# EAGLE design Power-Board (EAGLE 7.2.0)
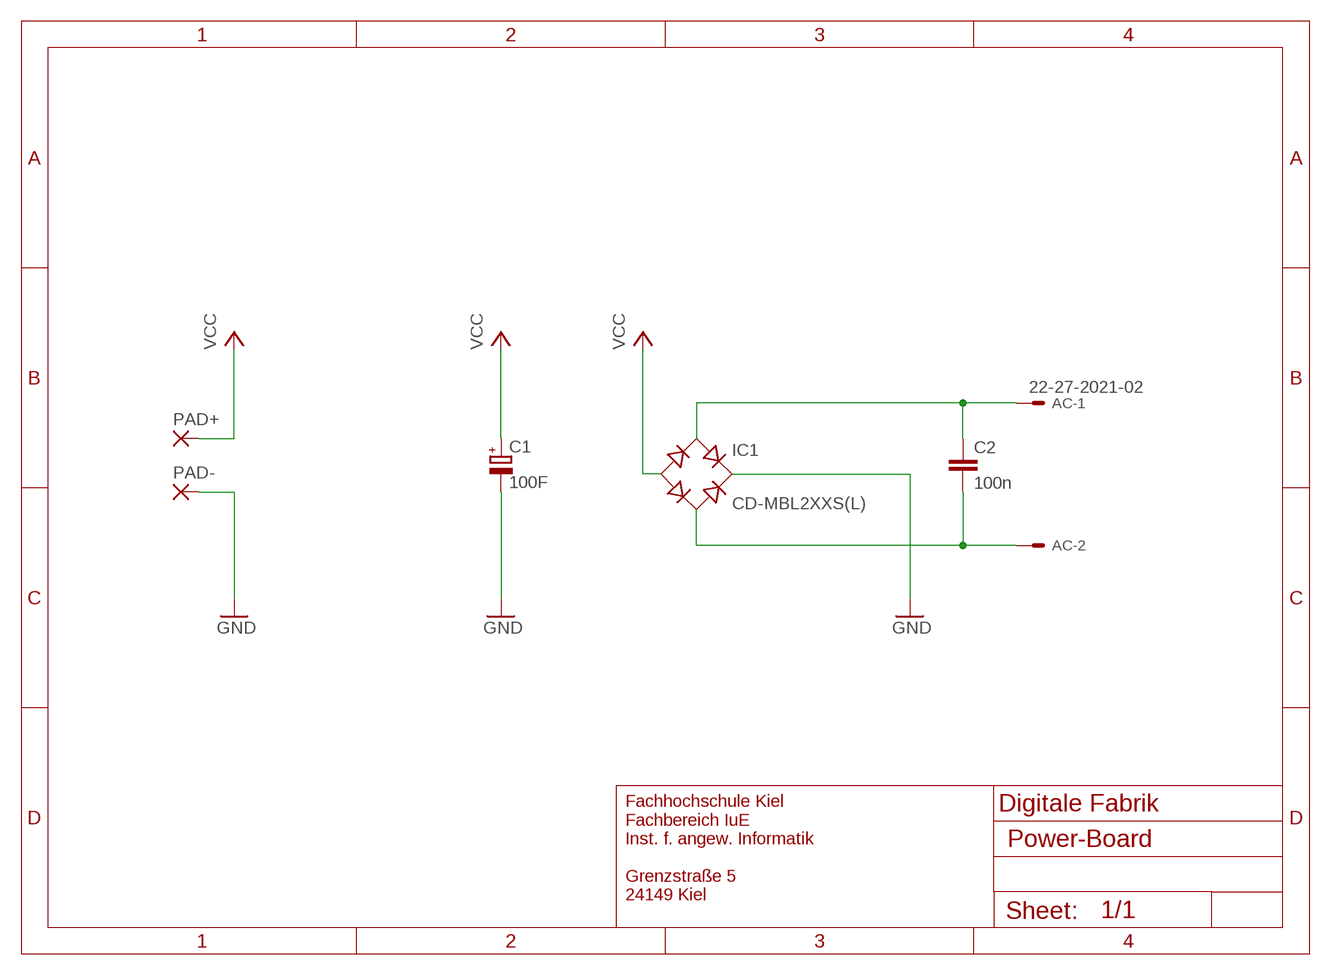
[diagram p0: schematic, sheet 1]

## Parts
AC  22-27-2021-02  [6410-02]
C1  100F  CPOL-EUE7,5-18,5  [E7,5-18,5]
C2  100n  C-EUC0805K  [C0805K]
IC1  CD-MBL2XXS(L)  [CD-MBL2XXS(L)]
PAD+  WIREPAD4,16O1,6  [4,16O1,6]
PAD-  WIREPAD4,16O1,6  [4,16O1,6]

## Nets
GND: C1.- IC1.DC+(+) PAD-.1(P)
N$1: AC.1 C2.1 IC1.AC1
N$2: AC.2 C2.2 IC1.AC2
VCC: C1.+ IC1.DC-(-) PAD+.1(P)

## Notes on the sheet
- Digitale Fabrik
- Fachhochschule Kiel
  Fachbereich IuE
  Inst. f. angew. Informatik
  
  Grenzstraße 5
  24149 Kiel

## Library data of the parts
AC = con-molex:22-?-02: CONNECTOR wire to board 2.54 mm (.1 inch) pitch header
C1 = rcl:CPOL-EU: POLARIZED CAPACITOR, European symbol
C2 = rcl:C-EU: CAPACITOR, European symbol
IC1 = rectifier:CD-MBL2XXS(L): Bourns CD-MBL2xxS(L) series SMT bridge rectifier diode
PAD+ PAD- = wirepad:WIREPAD: Wire PAD connect wire on PCB

## Board
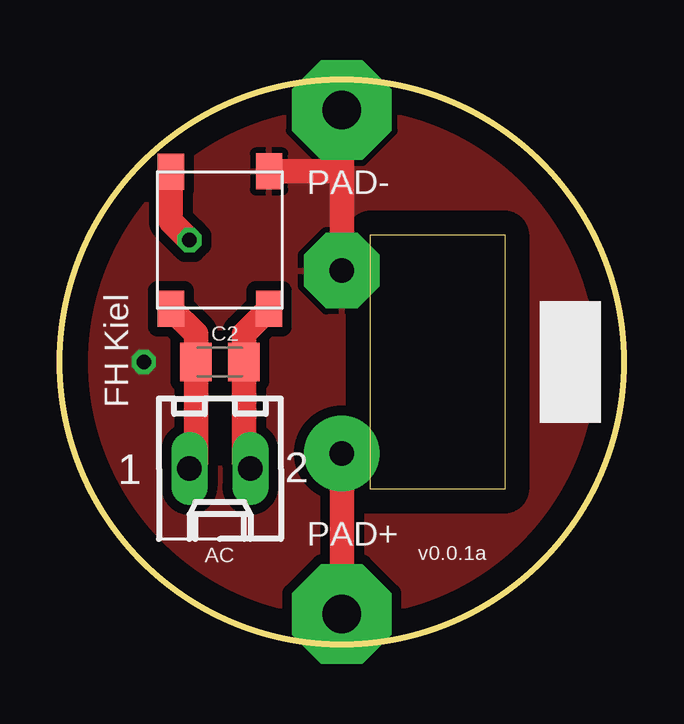
[diagram p1: board, top side]
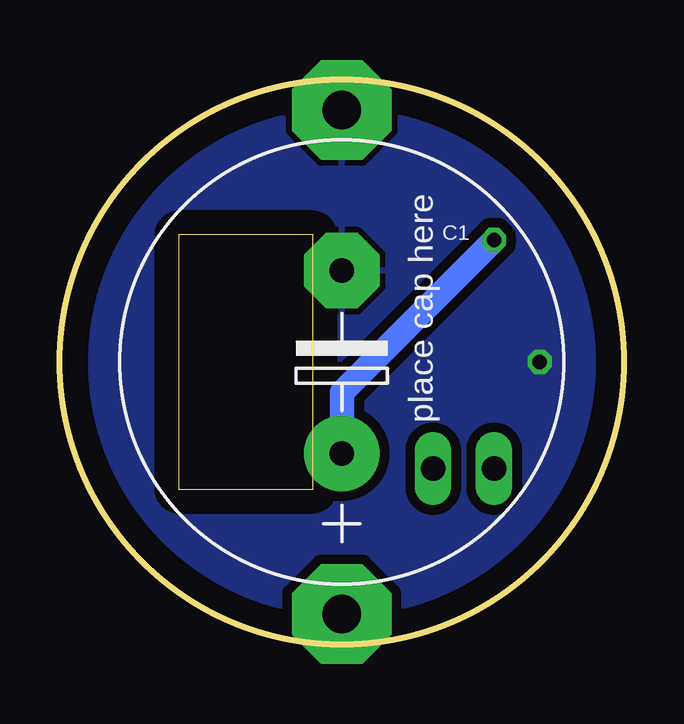
[diagram p2: board, bottom side, seen from below]

Size 23.5 x 23.5 mm. Coordinates in mm from the lower left corner, seen from the top.
Outline: 12.95,17.05 18.55,17.05 18.55,6.45 12.95,6.45 12.95,17.05
Outline: circle at 11.75,11.75 radius 11.75
Copper layers (1*16): Top 0.035mm / dielectric 1.5mm / Bottom 0.035mm
Design rules "default": minimum track width 10mil, minimum drill 24mil, track to track 8mil, track to pad 8mil, pad to pad 8mil, via to via 8mil, smd to smd 8mil, copper to edge 40mil, drill to drill 8mil, minimum pad ring 10mil, minimum via ring 8mil, stop-mask expansion 4mil, vias tented up to drill 0mil, thermal gap 10mil

### Footprints (pad centres in the part's own frame; a part is rotated, then mirrored left to right if it is on the bottom)
6410-02 = drill 1.016 long: 1 1.27,0; 2 -1.27,0
E7,5-18,5 = drill 1.016 pad 3.15: + -3.81,0 | drill 1.016 pad 3.15 octagon: - 3.81,0
C0805K = smd 1.3 x 1.6: 1 -1,0; 2 1,0
CD-MBL2XXS(L) = smd 1.1 x 1.5: AC1 -2.05,-2.86; AC2 2.05,-2.86; DC+ 2.05,2.86; DC- -2.05,2.85
4,16O1,6 = drill 1.6 pad 4.166 octagon: 1 0,0

### Placement (x,y rotation side)
AC  6.67,7.3 180 top
C1  11.75,11.75 90 bottom
C2  6.67,11.75 0 top
IC1  6.67,16.83 0 top
PAD+  11.75,1.25 0 top
PAD-  11.75,22.25 0 top

### Tracks (layer width: path | path; a pad name or v marks a point on that pad's centre or on a via)
GND  (via drill 0.6)
  Top 1.016: C1.- 11.75,20.01 | 11.75,20.01 PAD-.1 | IC1.DC+ 11.44,19.69 11.75,20.01
  other vias: 3.49,11.75
  pour Bottom (isolate 0.406): -0.31,-0.31 -0.31,23.81 23.81,23.81 23.81,-0.31
  pour Top (isolate 0.406): -0.31,-0.31 -0.31,23.81 23.81,23.81 23.81,-0.31
N$1
  Top 1.016: IC1.AC1 5.67,12.92 C2.1 5.67,7.58 AC.1
N$2
  Top 1.016: IC1.AC2 7.67,12.92 C2.2 7.67,7.58 AC.2
VCC  (via drill 0.6)
  Top 1.016: C1.+ PAD+.1 | IC1.DC- 4.62,17.61 v5.4,16.83
  Bottom 1.016: v5.4,16.83 11.75,10.48 C1.+

### Text on the board
tNames: FH Kiel | v0.0.1a
bNames: place cap here